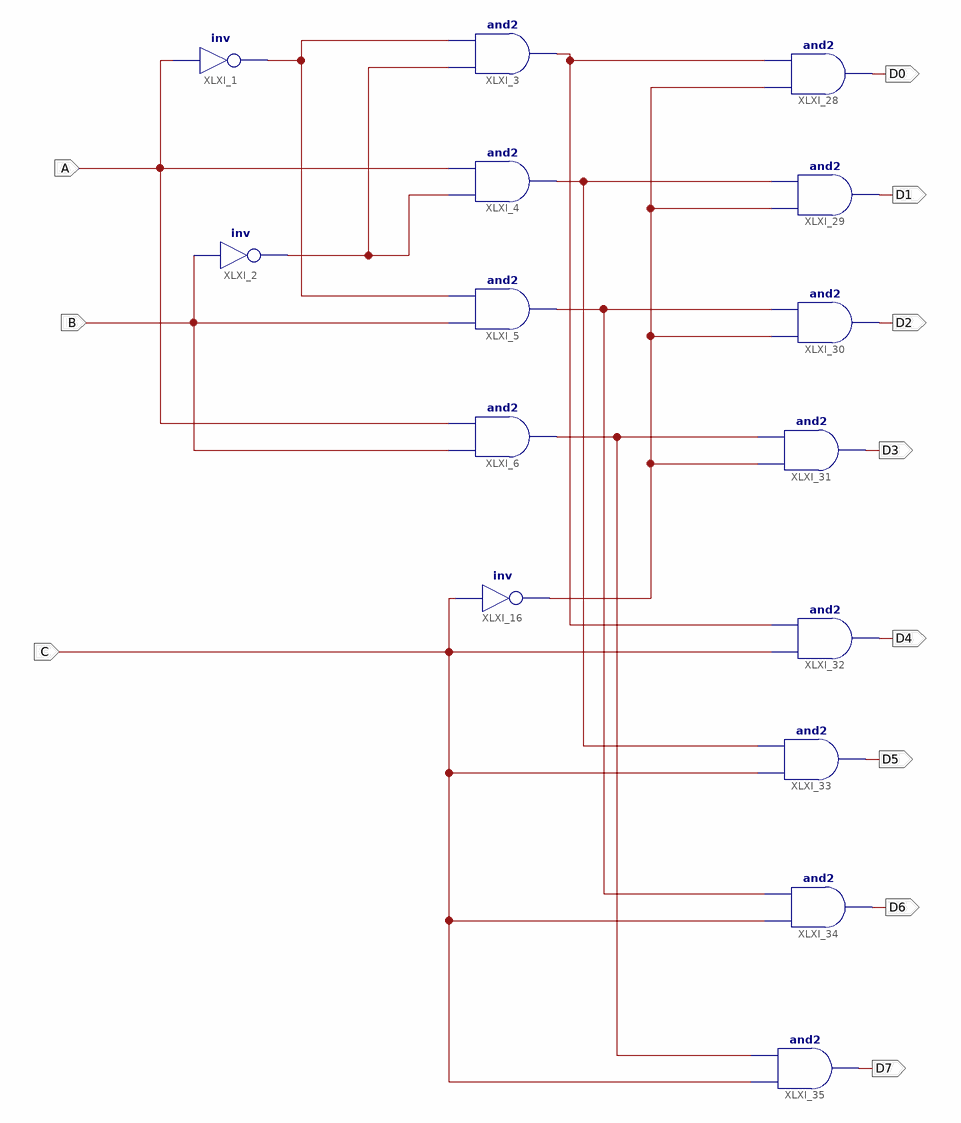
[diagram p0: schematic sheet 1]
// Xilinx ISE schematic Decoder_38_sch.sch (kintex7) as structural Verilog: 15 symbols, 11 ports
module Decoder_38_sch (
  input  A,
  input  B,
  input  C,
  output D0,
  output D1,
  output D2,
  output D3,
  output D4,
  output D5,
  output D6,
  output D7
);

  wire XLXN_6, XLXN_7, XLXN_16, XLXN_17, XLXN_18, XLXN_19, XLXN_30;

  not XLXI_1 (XLXN_6, A);
  not XLXI_2 (XLXN_7, B);
  and XLXI_3 (XLXN_16, XLXN_7, XLXN_6);
  and XLXI_4 (XLXN_17, XLXN_7, A);
  and XLXI_5 (XLXN_18, B, XLXN_6);
  and XLXI_6 (XLXN_19, B, A);
  not XLXI_16 (XLXN_30, C);
  and XLXI_28 (D0, XLXN_30, XLXN_16);
  and XLXI_29 (D1, XLXN_30, XLXN_17);
  and XLXI_30 (D2, XLXN_30, XLXN_18);
  and XLXI_31 (D3, XLXN_30, XLXN_19);
  and XLXI_32 (D4, C, XLXN_16);
  and XLXI_33 (D5, C, XLXN_17);
  and XLXI_34 (D6, C, XLXN_18);
  and XLXI_35 (D7, C, XLXN_19);
endmodule
